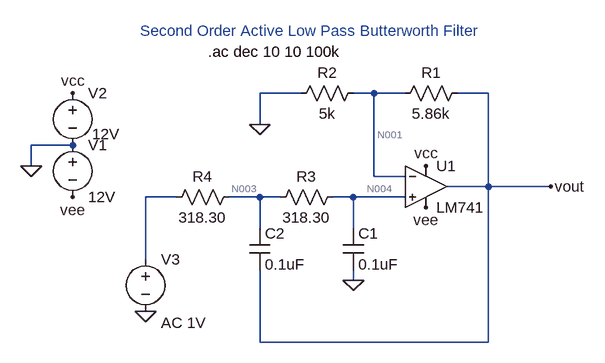
[diagram p0: schematic secondorderlowpass.asc]
secondorderlowpass.asc, the LTspice schematic file:
Version 4.1
SHEET 1 880 680
WIRE 304 -96 240 -96
WIRE 416 -96 384 -96
WIRE 464 -96 416 -96
WIRE 592 -96 544 -96
WIRE 240 -48 240 -96
WIRE -48 -16 -112 -16
WIRE -112 16 -112 -16
WIRE 416 32 416 -96
WIRE 464 32 416 32
WIRE 592 48 592 -96
WIRE 592 48 528 48
WIRE 688 48 592 48
WIRE 112 64 64 64
WIRE 240 64 192 64
WIRE 272 64 240 64
WIRE 384 64 352 64
WIRE 464 64 384 64
WIRE 240 112 240 64
WIRE 384 112 384 64
WIRE 64 160 64 64
WIRE 384 192 384 176
WIRE 240 288 240 176
WIRE 592 288 592 48
WIRE 592 288 240 288
FLAG -112 16 0
FLAG 496 16 vcc
FLAG -48 -96 vcc
FLAG -48 64 vee
FLAG 496 80 vee
FLAG 240 -48 0
FLAG 384 192 0
FLAG 64 240 0
FLAG 688 48 vout
SYMBOL voltage -48 -32 R0
WINDOW 123 0 0 Left 0
WINDOW 39 0 0 Left 0
SYMATTR InstName V1
SYMATTR Value 12V
SYMBOL voltage -48 -112 R0
WINDOW 3 30 79 Left 2
WINDOW 123 0 0 Left 0
WINDOW 39 0 0 Left 0
SYMATTR Value 12V
SYMATTR InstName V2
SYMBOL LM741 496 -16 R0
SYMATTR InstName U1
SYMBOL res 560 -112 R90
WINDOW 0 0 56 VBottom 2
WINDOW 3 32 56 VTop 2
SYMATTR InstName R1
SYMATTR Value 5.86k
SYMBOL res 400 -112 R90
WINDOW 0 0 56 VBottom 2
WINDOW 3 32 56 VTop 2
SYMATTR InstName R2
SYMATTR Value 5k
SYMBOL cap 368 112 R0
SYMATTR InstName C1
SYMATTR Value 0.1uF
SYMBOL cap 224 112 R0
SYMATTR InstName C2
SYMATTR Value 0.1uF
SYMBOL res 368 48 R90
WINDOW 0 0 56 VBottom 2
WINDOW 3 32 56 VTop 2
SYMATTR InstName R3
SYMATTR Value 318.30
SYMBOL res 208 48 R90
WINDOW 0 0 56 VBottom 2
WINDOW 3 32 56 VTop 2
SYMATTR InstName R4
SYMATTR Value 318.30
SYMBOL voltage 64 144 R0
WINDOW 123 24 114 Left 2
WINDOW 39 0 0 Left 0
SYMATTR Value2 AC 1V
SYMATTR InstName V3
SYMATTR Value ""
TEXT 56 -192 Left 2 ;Second Order Active Low Pass Butterworth Filter
TEXT 160 -160 Left 2 !.ac dec 10 10 100k

The netlist it stands for:
* secondorderlowpass.asc
V1 0 vee 12V
V2 vcc 0 12V
X§U1 N004 N001 vcc vee vout LM741  ; pins In+ In- V+ V- OUT
R1 vout N001 5.86k
R2 N001 0 5k
C1 N004 0 0.1uF
C2 N003 vout 0.1uF
R3 N004 N003 318.30
R4 N003 N002 318.30
V3 N002 0 AC 1V
* Second Order Active Low Pass Butterworth Filter
.ac dec 10 10 100k
.lib LM741.lib
.backanno
.end

* Results of the author's LTspice run, read from the files saved beside the schematic
* Operating Point, zero values left out:
*   V(vcc) = 12 V
*   V(n001) = 963.2 µV
*   V(vout) = 2.689 mV
*   V(vee) = -12 V
*   V(n004) = -36.83 µV
*   V(n003) = -18.42 µV
*   I(V1) = -1.626 mA
*   I(R2) = 192.6 nA
*   I(R3) = -57.86 nA
*   I(V3) = -57.86 nA
*   I(R4) = -57.86 nA
*   I(V2) = -1.626 mA
*   I(R1) = 294.5 nA
*   Ix(u1:1) = 57.86 nA
*   Ix(u1:2) = 101.9 nA
*   Ix(u1:99) = 1.626 mA
*   Ix(u1:50) = -1.626 mA
*   Ix(u1:28) = -294.5 nA